# Altium schematic sheet DSPCONN2.SCHDOC
size B
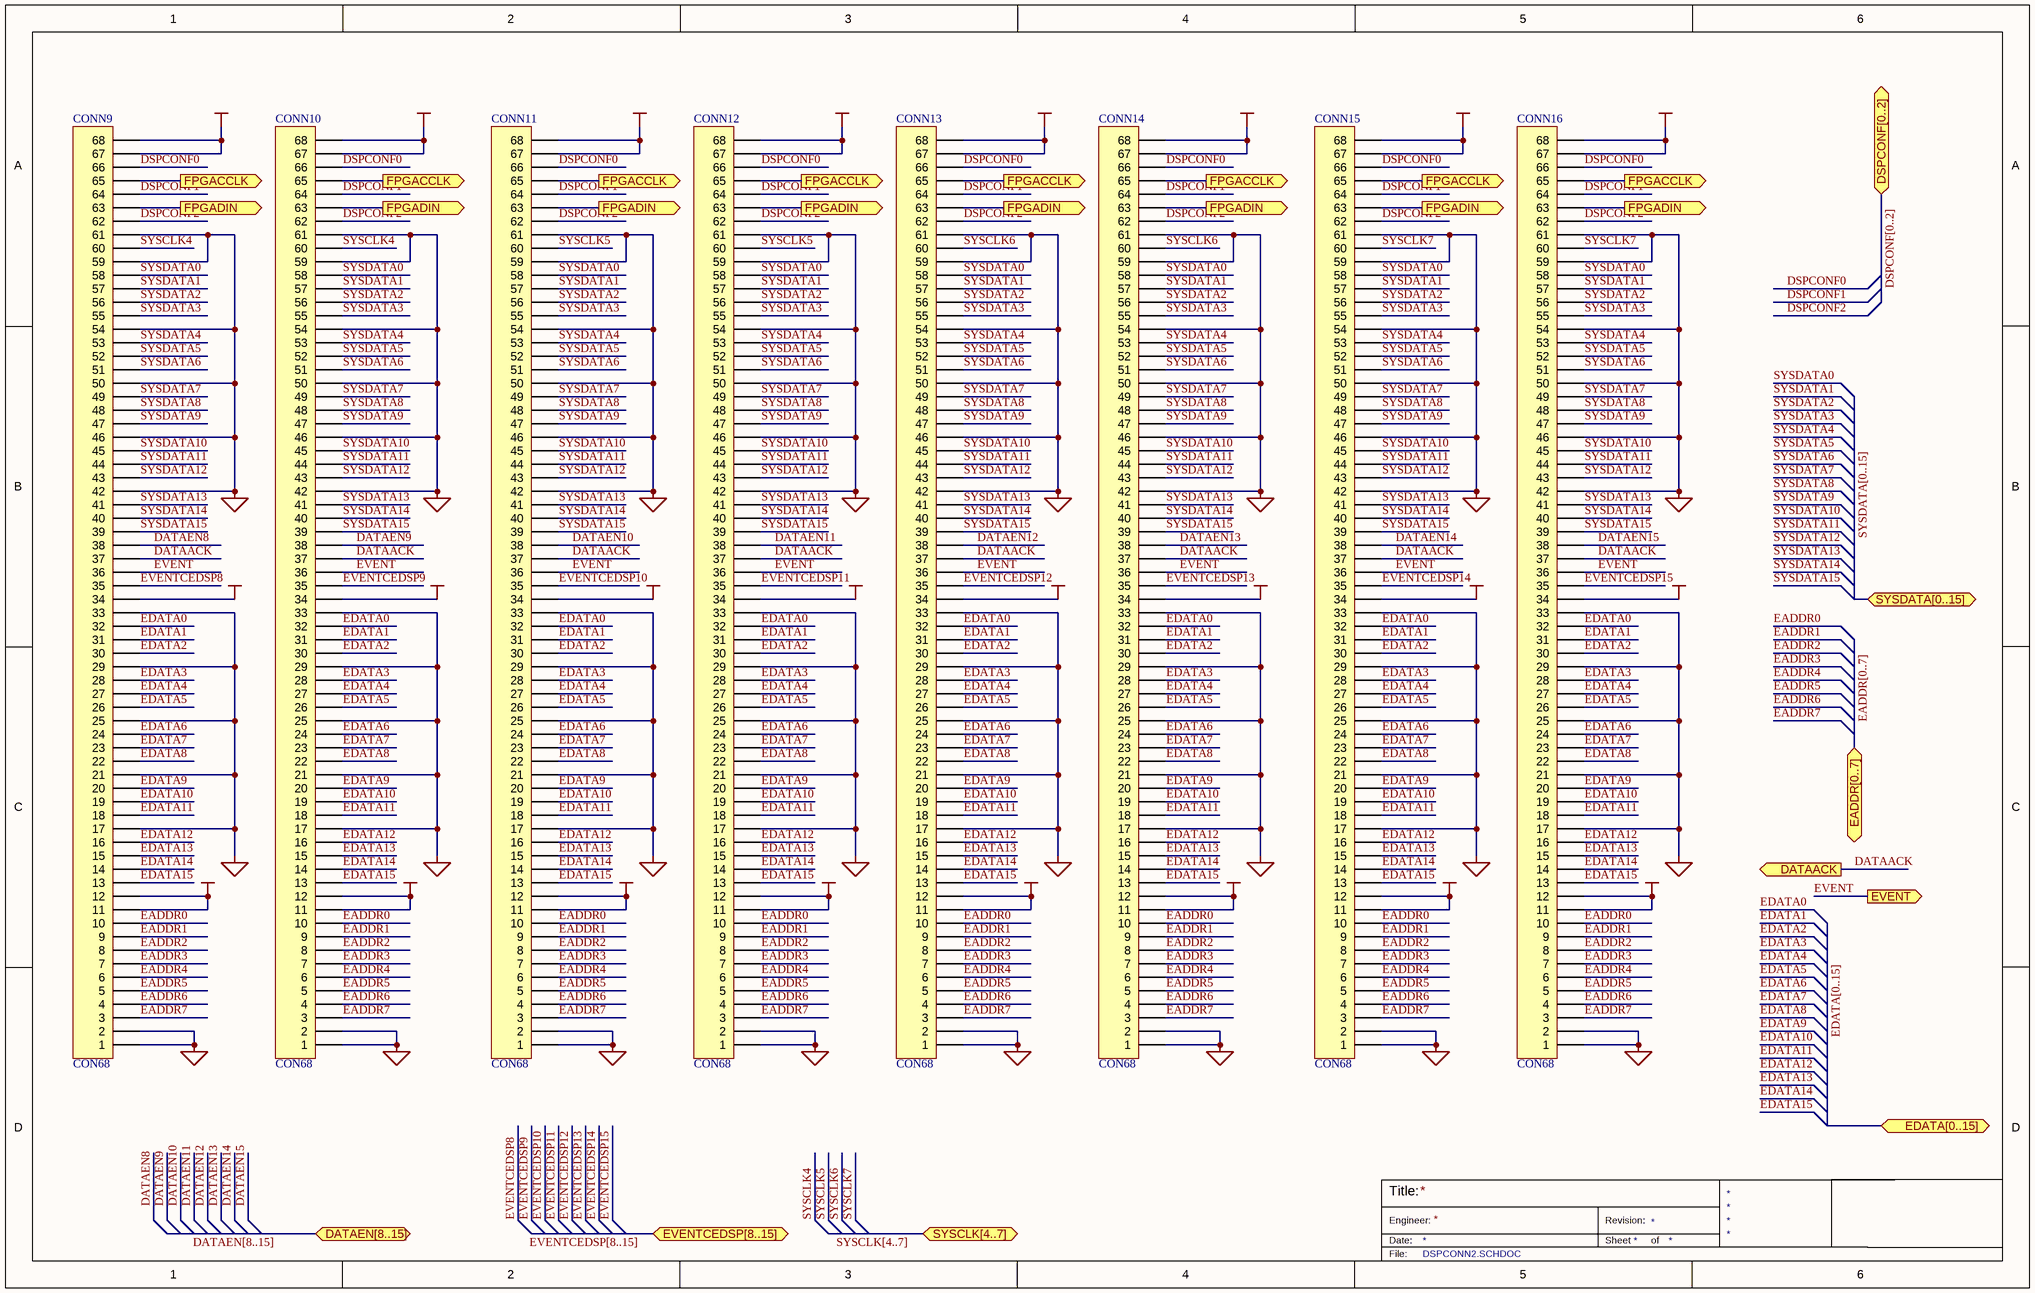
[diagram p0: DSPCONN2.SCHDOC]

## Parts
CONN9  CON68  [MOLEX 15921068]
CONN10  CON68  [MOLEX 15921068]
CONN11  CON68  [MOLEX 15921068]
CONN12  CON68  [MOLEX 15921068]
CONN13  CON68  [MOLEX 15921068]
CONN14  CON68  [MOLEX 15921068]
CONN15  CON68  [MOLEX 15921068]
CONN16  CON68  [MOLEX 15921068]

## Ports
DATAACK (out), DATAEN[8..15] (bidir), DSPCONF[0..2] (bidir), EADDR[0..7] (bidir), EDATA[0..15] (bidir), EVENT (out), EVENTCEDSP[8..15] (bidir), FPGACCLK (out), FPGADIN (out), SYSCLK[4..7] (bidir), SYSDATA[0..15] (bidir)

## Nets
+5VCC: CONN9.34 CONN10.34 CONN11.34 CONN12.34 CONN13.34 CONN14.34 CONN15.34 CONN16.34
GND: CONN9.1 CONN9.2 CONN9.17 CONN9.21 CONN9.25 CONN9.29 CONN9.33 CONN9.42 CONN9.46 CONN9.50 CONN9.54 CONN9.59 CONN9.61 CONN10.1 CONN10.2 CONN10.17 CONN10.21 CONN10.25 CONN10.29 CONN10.33 CONN10.42 CONN10.46 CONN10.50 CONN10.54 CONN10.59 CONN10.61 CONN11.1 CONN11.2 CONN11.17 CONN11.21 CONN11.25 CONN11.29 CONN11.33 CONN11.42 CONN11.46 CONN11.50 CONN11.54 CONN11.59 CONN11.61 CONN12.1 CONN12.2 CONN12.17 CONN12.21 CONN12.25 CONN12.29 CONN12.33 CONN12.42 CONN12.46 CONN12.50 CONN12.54 CONN12.59 CONN12.61 CONN13.1 CONN13.2 CONN13.17 CONN13.21 CONN13.25 CONN13.29 CONN13.33 CONN13.42 CONN13.46 CONN13.50 CONN13.54 CONN13.59 CONN13.61 CONN14.1 CONN14.2 CONN14.17 CONN14.21 CONN14.25 CONN14.29 CONN14.33 CONN14.42 CONN14.46 CONN14.50 CONN14.54 CONN14.59 CONN14.61 CONN15.1 CONN15.2 CONN15.17 CONN15.21 CONN15.25 CONN15.29 CONN15.33 CONN15.42 CONN15.46 CONN15.50 CONN15.54 CONN15.59 CONN15.61 CONN16.1 CONN16.2 CONN16.17 CONN16.21 CONN16.25 CONN16.29 CONN16.33 CONN16.42 CONN16.46 CONN16.50 CONN16.54 CONN16.59 CONN16.61
VCC2: CONN9.11 CONN9.12 CONN9.67 CONN9.68 CONN10.11 CONN10.12 CONN10.67 CONN10.68 CONN11.11 CONN11.12 CONN11.67 CONN11.68 CONN12.11 CONN12.12 CONN12.67 CONN12.68 CONN13.11 CONN13.12 CONN13.67 CONN13.68 CONN14.11 CONN14.12 CONN14.67 CONN14.68 CONN15.11 CONN15.12 CONN15.67 CONN15.68 CONN16.11 CONN16.12 CONN16.67 CONN16.68
DATAACK: CONN9.37 CONN10.37 CONN11.37 CONN12.37 CONN13.37 CONN14.37 CONN15.37 CONN16.37 ; port DATAACK
DATAEN8: CONN9.38
DATAEN9: CONN10.38
DATAEN10: CONN11.38
DATAEN11: CONN12.38
DATAEN12: CONN13.38
DATAEN13: CONN14.38
DATAEN14: CONN15.38
DATAEN15: CONN16.38
DSPCONF0: CONN9.66 CONN10.66 CONN11.66 CONN12.66 CONN13.66 CONN14.66 CONN15.66 CONN16.66
DSPCONF1: CONN9.64 CONN10.64 CONN11.64 CONN12.64 CONN13.64 CONN14.64 CONN15.64 CONN16.64
DSPCONF2: CONN9.62 CONN10.62 CONN11.62 CONN12.62 CONN13.62 CONN14.62 CONN15.62 CONN16.62
EADDR0: CONN9.10 CONN10.10 CONN11.10 CONN12.10 CONN13.10 CONN14.10 CONN15.10 CONN16.10
EADDR1: CONN9.9 CONN10.9 CONN11.9 CONN12.9 CONN13.9 CONN14.9 CONN15.9 CONN16.9
EADDR2: CONN9.8 CONN10.8 CONN11.8 CONN12.8 CONN13.8 CONN14.8 CONN15.8 CONN16.8
EADDR3: CONN9.7 CONN10.7 CONN11.7 CONN12.7 CONN13.7 CONN14.7 CONN15.7 CONN16.7
EADDR4: CONN9.6 CONN10.6 CONN11.6 CONN12.6 CONN13.6 CONN14.6 CONN15.6 CONN16.6
EADDR5: CONN9.5 CONN10.5 CONN11.5 CONN12.5 CONN13.5 CONN14.5 CONN15.5 CONN16.5
EADDR6: CONN9.4 CONN10.4 CONN11.4 CONN12.4 CONN13.4 CONN14.4 CONN15.4 CONN16.4
EADDR7: CONN9.3 CONN10.3 CONN11.3 CONN12.3 CONN13.3 CONN14.3 CONN15.3 CONN16.3
EDATA0: CONN9.32 CONN10.32 CONN11.32 CONN12.32 CONN13.32 CONN14.32 CONN15.32 CONN16.32
EDATA1: CONN9.31 CONN10.31 CONN11.31 CONN12.31 CONN13.31 CONN14.31 CONN15.31 CONN16.31
EDATA2: CONN9.30 CONN10.30 CONN11.30 CONN12.30 CONN13.30 CONN14.30 CONN15.30 CONN16.30
EDATA3: CONN9.28 CONN10.28 CONN11.28 CONN12.28 CONN13.28 CONN14.28 CONN15.28 CONN16.28
EDATA4: CONN9.27 CONN10.27 CONN11.27 CONN12.27 CONN13.27 CONN14.27 CONN15.27 CONN16.27
EDATA5: CONN9.26 CONN10.26 CONN11.26 CONN12.26 CONN13.26 CONN14.26 CONN15.26 CONN16.26
EDATA6: CONN9.24 CONN10.24 CONN11.24 CONN12.24 CONN13.24 CONN14.24 CONN15.24 CONN16.24
EDATA7: CONN9.23 CONN10.23 CONN11.23 CONN12.23 CONN13.23 CONN14.23 CONN15.23 CONN16.23
EDATA8: CONN9.22 CONN10.22 CONN11.22 CONN12.22 CONN13.22 CONN14.22 CONN15.22 CONN16.22
EDATA9: CONN9.20 CONN10.20 CONN11.20 CONN12.20 CONN13.20 CONN14.20 CONN15.20 CONN16.20
EDATA10: CONN9.19 CONN10.19 CONN11.19 CONN12.19 CONN13.19 CONN14.19 CONN15.19 CONN16.19
EDATA11: CONN9.18 CONN10.18 CONN11.18 CONN12.18 CONN13.18 CONN14.18 CONN15.18 CONN16.18
EDATA12: CONN9.16 CONN10.16 CONN11.16 CONN12.16 CONN13.16 CONN14.16 CONN15.16 CONN16.16
EDATA13: CONN9.15 CONN10.15 CONN11.15 CONN12.15 CONN13.15 CONN14.15 CONN15.15 CONN16.15
EDATA14: CONN9.14 CONN10.14 CONN11.14 CONN12.14 CONN13.14 CONN14.14 CONN15.14 CONN16.14
EDATA15: CONN9.13 CONN10.13 CONN11.13 CONN12.13 CONN13.13 CONN14.13 CONN15.13 CONN16.13
EVENT: CONN9.36 CONN10.36 CONN11.36 CONN12.36 CONN13.36 CONN14.36 CONN15.36 CONN16.36 ; port EVENT
EVENTCEDSP8: CONN9.35
EVENTCEDSP9: CONN10.35
EVENTCEDSP10: CONN11.35
EVENTCEDSP11: CONN12.35
EVENTCEDSP12: CONN13.35
EVENTCEDSP13: CONN14.35
EVENTCEDSP14: CONN15.35
EVENTCEDSP15: CONN16.35
FPGACCLK: CONN9.65 CONN10.65 CONN11.65 CONN12.65 CONN13.65 CONN14.65 CONN15.65 CONN16.65 ; port FPGACCLK
FPGADIN: CONN9.63 CONN10.63 CONN11.63 CONN12.63 CONN13.63 CONN14.63 CONN15.63 CONN16.63 ; port FPGADIN
SYSCLK4: CONN9.60 CONN10.60
SYSCLK5: CONN11.60 CONN12.60
SYSCLK6: CONN13.60 CONN14.60
SYSCLK7: CONN15.60 CONN16.60
SYSDATA0: CONN9.58 CONN10.58 CONN11.58 CONN12.58 CONN13.58 CONN14.58 CONN15.58 CONN16.58
SYSDATA1: CONN9.57 CONN10.57 CONN11.57 CONN12.57 CONN13.57 CONN14.57 CONN15.57 CONN16.57
SYSDATA2: CONN9.56 CONN10.56 CONN11.56 CONN12.56 CONN13.56 CONN14.56 CONN15.56 CONN16.56
SYSDATA3: CONN9.55 CONN10.55 CONN11.55 CONN12.55 CONN13.55 CONN14.55 CONN15.55 CONN16.55
SYSDATA4: CONN9.53 CONN10.53 CONN11.53 CONN12.53 CONN13.53 CONN14.53 CONN15.53 CONN16.53
SYSDATA5: CONN9.52 CONN10.52 CONN11.52 CONN12.52 CONN13.52 CONN14.52 CONN15.52 CONN16.52
SYSDATA6: CONN9.51 CONN10.51 CONN11.51 CONN12.51 CONN13.51 CONN14.51 CONN15.51 CONN16.51
SYSDATA7: CONN9.49 CONN10.49 CONN11.49 CONN12.49 CONN13.49 CONN14.49 CONN15.49 CONN16.49
SYSDATA8: CONN9.48 CONN10.48 CONN11.48 CONN12.48 CONN13.48 CONN14.48 CONN15.48 CONN16.48
SYSDATA9: CONN9.47 CONN10.47 CONN11.47 CONN12.47 CONN13.47 CONN14.47 CONN15.47 CONN16.47
SYSDATA10: CONN9.45 CONN10.45 CONN11.45 CONN12.45 CONN13.45 CONN14.45 CONN15.45 CONN16.45
SYSDATA11: CONN9.44 CONN10.44 CONN11.44 CONN12.44 CONN13.44 CONN14.44 CONN15.44 CONN16.44
SYSDATA12: CONN9.43 CONN10.43 CONN11.43 CONN12.43 CONN13.43 CONN14.43 CONN15.43 CONN16.43
SYSDATA13: CONN9.41 CONN10.41 CONN11.41 CONN12.41 CONN13.41 CONN14.41 CONN15.41 CONN16.41
SYSDATA14: CONN9.40 CONN10.40 CONN11.40 CONN12.40 CONN13.40 CONN14.40 CONN15.40 CONN16.40
SYSDATA15: CONN9.39 CONN10.39 CONN11.39 CONN12.39 CONN13.39 CONN14.39 CONN15.39 CONN16.39

## Buses and harness runs
bus DATAEN[8..15] = port DATAEN[8..15]
bus DSPCONF[0..2] = port DSPCONF[0..2]
bus EADDR[0..7] = port EADDR[0..7]
bus EDATA[0..15] = port EDATA[0..15]
bus EVENTCEDSP[8..15] = port EVENTCEDSP[8..15]
bus SYSCLK[4..7] = port SYSCLK[4..7]
bus SYSDATA[0..15] = port SYSDATA[0..15]

## Notes on the sheet
- Title:
- Engineer:
- Date:
- Revision:
- Sheet
- of
- File: